# Altium schematic sheet EN-C200_RA0_MCU_只有元器件.SchDoc: STM32L433
size A4; DocumentNumber: EN-C200
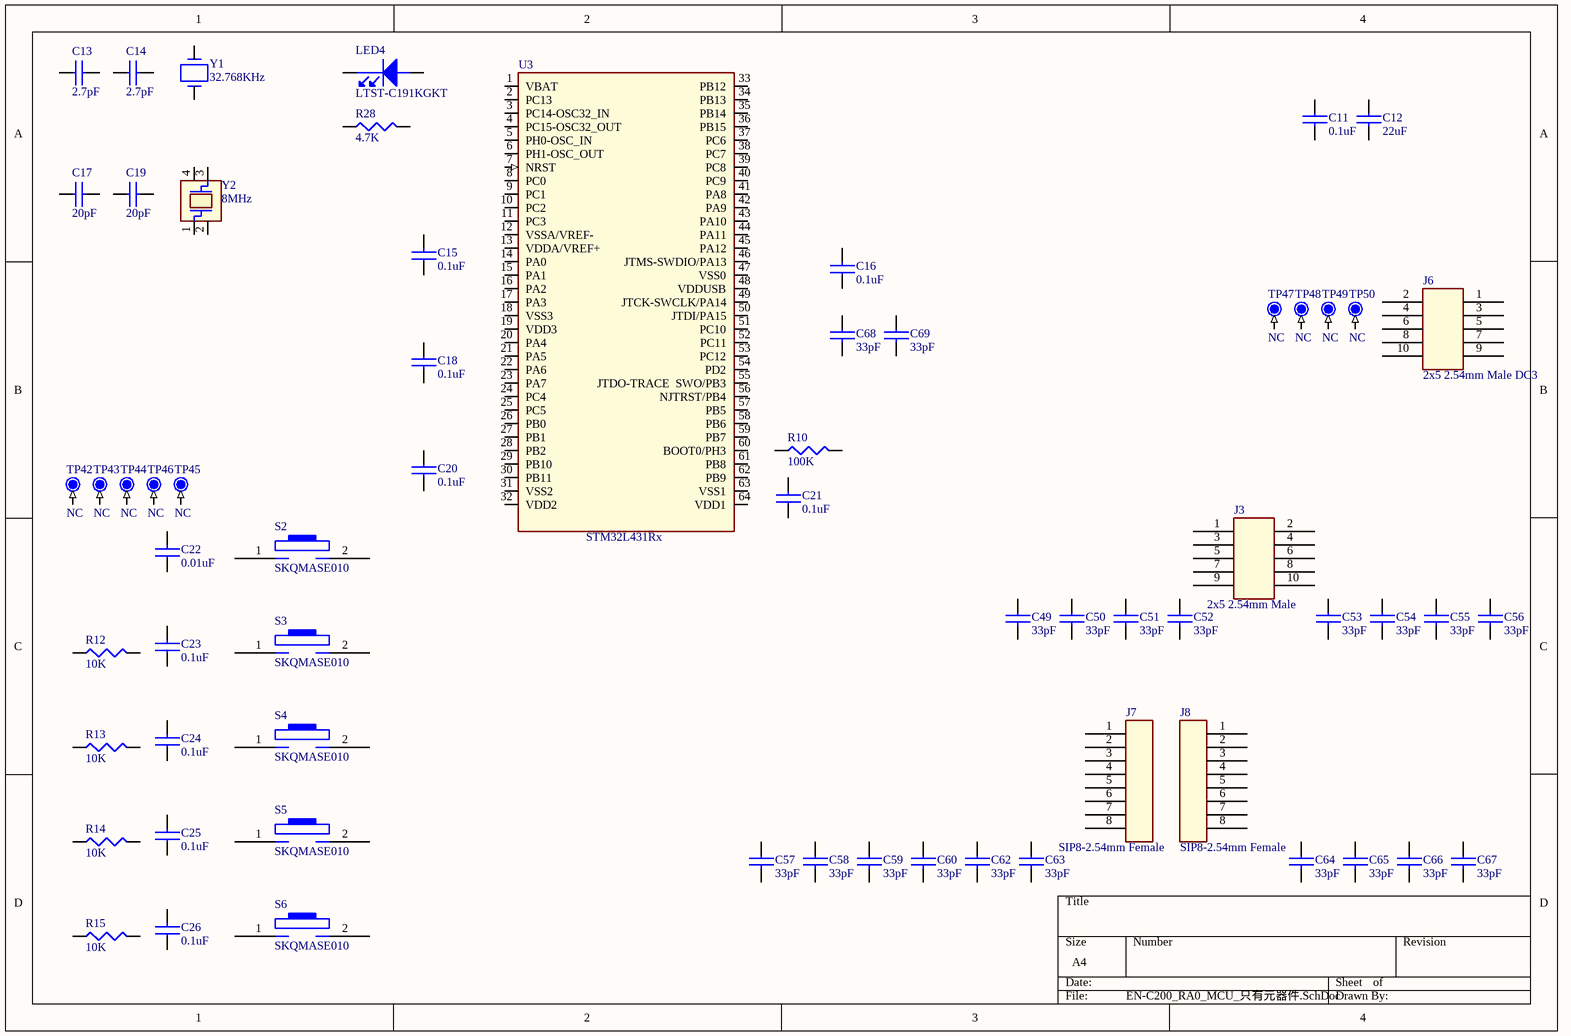
[diagram p0: EN-C200_RA0_MCU_只有元器件.SchDoc]

## Parts
C11  0.1uF  [SC0603]
C12  22uF  [SC0805]
C13  2.7pF  [SC0603]
C14  2.7pF  [SC0603]
C15  0.1uF  [SC0603]
C16  0.1uF  [SC0603]
C17  20pF  [SC0603]
C18  0.1uF  [SC0603]
C19  20pF  [SC0603]
C20  0.1uF  [SC0603]
C21  0.1uF  [SC0603]
C22  0.01uF  [SC0603]
C23  0.1uF  [SC0603]
C24  0.1uF  [SC0603]
C25  0.1uF  [SC0603]
C26  0.1uF  [SC0603]
C49  33pF  [SC0603]
C50  33pF  [SC0603]
C51  33pF  [SC0603]
C52  33pF  [SC0603]
C53  33pF  [SC0603]
C54  33pF  [SC0603]
C55  33pF  [SC0603]
C56  33pF  [SC0603]
C57  33pF  [SC0603]
C58  33pF  [SC0603]
C59  33pF  [SC0603]
C60  33pF  [SC0603]
C62  33pF  [SC0603]
C63  33pF  [SC0603]
C64  33pF  [SC0603]
C65  33pF  [SC0603]
C66  33pF  [SC0603]
C67  33pF  [SC0603]
C68  33pF  [SC0603]
C69  33pF  [SC0603]
J3  2x5 2.54mm Male  [SIP-2X5P-100]
J6  2x5 2.54mm Male DC3  [SIP-2X5P-100-DS]
J7  SIP8-2.54mm Female  [SIP-8P-100]
J8  SIP8-2.54mm Female  [SIP-8P-100]
LED4  LTST-C191KGKT  [HSD0603-LED]
R10  100K  [SR0603]
R12  10K  [SR0603]
R13  10K  [SR0603]
R14  10K  [SR0603]
R15  10K  [SR0603]
R28  4.7K  [SR0603]
S2  SKQMASE010  [SW2-240X140]
S3  SKQMASE010  [SW2-240X140]
S4  SKQMASE010  [SW2-240X140]
S5  SKQMASE010  [SW2-240X140]
S6  SKQMASE010  [SW2-240X140]
TP42  NC  [TP32-SMD]
TP43  NC  [TP32-SMD]
TP44  NC  [TP32-SMD]
TP45  NC  [TP32-SMD]
TP46  NC  [TP32-SMD]
TP47  NC  [TP32-SMD]
TP48  NC  [TP32-SMD]
TP49  NC  [TP32-SMD]
TP50  NC  [TP32-SMD]
U3  STM32L431Rx  [QFP64D-050-1010L]
Y1  32.768KHz  [FC-135_110]
Y2  8MHz  [HSX4-0503B]

## Nets

Not connected (* = marked no-connect by the designer): C11 1 2; C12 1 2; C13 1 2; C14 1 2; C15 1 2; C16 1 2; C17 1 2; C18 1 2; C19 1 2; C20 1 2; C21 1 2; C22 1 2; C23 1 2; C24 1 2; C25 1 2; C26 1 2; C49 1 2; C50 1 2; C51 1 2; C52 1 2; C53 1 2; C54 1 2; C55 1 2; C56 1 2; C57 1 2; C58 1 2; C59 1 2; C60 1 2; C62 1 2; C63 1 2; C64 1 2; C65 1 2; C66 1 2; C67 1 2; C68 1 2; C69 1 2; J3 1 2 3 4 5 6 7 8 9 10; J6 1 2 3 4 5 6 7 8 9 10; J7 1 2 3 4 5 6 7 8; J8 1 2 3 4 5 6 7 8; LED4 1 2; R10 1 2; R12 1 2; R13 1 2; R14 1 2; R15 1 2; R28 1 2; S2 1(A) 2(B); S3 1(A) 2(B); S4 1(A) 2(B); S5 1(A) 2(B); S6 1(A) 2(B); TP42 1; TP43 1; TP44 1; TP45 1; TP46 1; TP47 1; TP48 1; TP49 1; TP50 1; U3 1(VBAT) 2(PC13) 3(PC14-OSC32_IN) 4(PC15-OSC32_OUT) 5(PH0-OSC_IN) 6(PH1-OSC_OUT) 7(NRST) 8(PC0) 9(PC1) 10(PC2) 11(PC3) 12(VSSA/VREF-) 13(VDDA/VREF+) 14(PA0) 15(PA1) 16(PA2) 17(PA3) 18(VSS3) 19(VDD3) 20(PA4) 21(PA5) 22(PA6) 23(PA7) 24(PC4) 25(PC5) 26(PB0) 27(PB1) 28(PB2) 29(PB10) 30(PB11) 31(VSS2) 32(VDD2) 33(PB12) 34(PB13) 35(PB14) 36(PB15) 37(PC6) 38(PC7) 39(PC8) 40(PC9) 41(PA8) 42(PA9) 43(PA10) 44(PA11) 45(PA12) 46(JTMS-SWDIO/PA13) 47(VSS0) 48(VDDUSB) 49(JTCK-SWCLK/PA14) 50(JTDI/PA15) 51(PC10) 52(PC11) 53(PC12) 54(PD2) 55(JTDO-TRACE__SWO/PB3) 56(NJTRST/PB4) 57(PB5) 58(PB6) 59(PB7) 60(BOOT0/PH3) 61(PB8) 62(PB9) 63(VSS1) 64(VDD1); Y1 1 2; Y2 1(CIN) 2 3(COUT) 4

## Library data of the parts
C11-C26 C49-C60 C62-C69 = CAP NP
J3 J6 = CON10A
J7 J8 = HEADER8
LED4 = LED
R10 R12-R15 R28 = RESISTOR
S2-S6 = PUSH-KEY
TP42-TP50 = TP
Y1 = CRYSTAL2P
Y2 = CRYSTAL4P